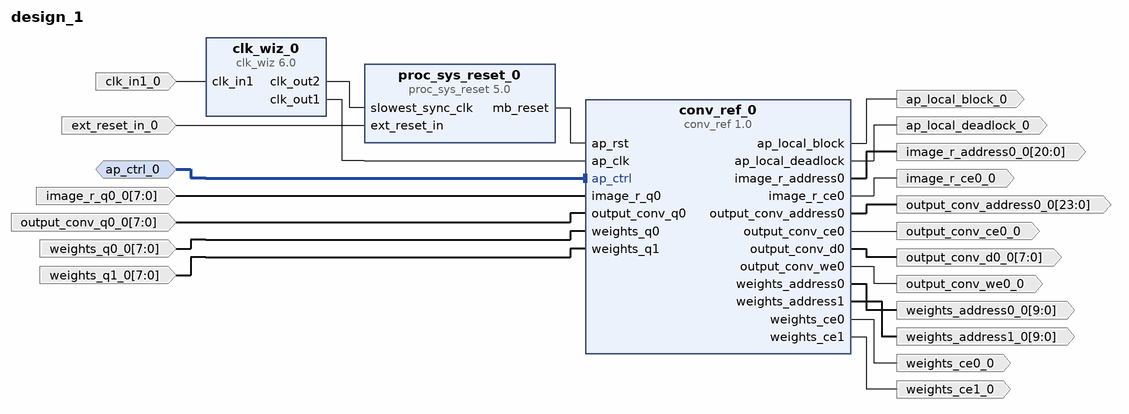
[diagram p0: block diagram of the top level]
# Vivado block design design_1, xczu7ev-ffvc1156-2-e, Vivado 2021.2
create_bd_design design_1

create_bd_intf_port -mode Slave -vlnv xilinx.com:interface:acc_handshake_rtl:1.0 ap_ctrl_0
create_bd_port -dir O ap_local_block_0
create_bd_port -dir O ap_local_deadlock_0
create_bd_port -dir O -from 20 -to 0 -type data image_r_address0_0
create_bd_port -dir O image_r_ce0_0
create_bd_port -dir I -from 7 -to 0 -type data image_r_q0_0
create_bd_port -dir O -from 23 -to 0 -type data output_conv_address0_0
create_bd_port -dir O output_conv_ce0_0
create_bd_port -dir O -from 7 -to 0 -type data output_conv_d0_0
create_bd_port -dir I -from 7 -to 0 -type data output_conv_q0_0
create_bd_port -dir O output_conv_we0_0
create_bd_port -dir O -from 9 -to 0 -type data weights_address0_0
create_bd_port -dir O -from 9 -to 0 -type data weights_address1_0
create_bd_port -dir O weights_ce0_0
create_bd_port -dir O weights_ce1_0
create_bd_port -dir I -from 7 -to 0 -type data weights_q0_0
create_bd_port -dir I -from 7 -to 0 -type data weights_q1_0
create_bd_port -dir I -type clk clk_in1_0
create_bd_port -dir I -type rst ext_reset_in_0

create_bd_cell -type ip -vlnv xilinx.com:hls:conv_ref:1.0 conv_ref_0
create_bd_cell -type ip -vlnv xilinx.com:ip:proc_sys_reset:5.0 proc_sys_reset_0
create_bd_cell -type ip -vlnv xilinx.com:ip:clk_wiz:6.0 clk_wiz_0
set_property -dict [list \
  CONFIG.CLKOUT2_JITTER 132.683 \
  CONFIG.CLKOUT2_PHASE_ERROR 87.180 \
  CONFIG.CLKOUT2_REQUESTED_OUT_FREQ 50.000 \
  CONFIG.CLKOUT2_USED true \
  CONFIG.MMCM_CLKOUT1_DIVIDE 24 \
  CONFIG.NUM_OUT_CLKS 2 \
  CONFIG.USE_LOCKED false \
  CONFIG.USE_RESET false \
] [get_bd_cells clk_wiz_0]

# ---- connections ----

connect_bd_intf_net -intf_net ap_ctrl_0_1 [get_bd_intf_ports ap_ctrl_0] [get_bd_intf_pins conv_ref_0/ap_ctrl]
connect_bd_net -net clk_in1_0_1 [get_bd_ports clk_in1_0] [get_bd_pins clk_wiz_0/clk_in1]
connect_bd_net [get_bd_pins clk_wiz_0/clk_out1] [get_bd_pins conv_ref_0/ap_clk]
connect_bd_net [get_bd_pins clk_wiz_0/clk_out2] [get_bd_pins proc_sys_reset_0/slowest_sync_clk]
connect_bd_net [get_bd_pins conv_ref_0/ap_local_block] [get_bd_ports ap_local_block_0]
connect_bd_net [get_bd_pins conv_ref_0/ap_local_deadlock] [get_bd_ports ap_local_deadlock_0]
connect_bd_net [get_bd_pins conv_ref_0/image_r_address0] [get_bd_ports image_r_address0_0]
connect_bd_net [get_bd_pins conv_ref_0/image_r_ce0] [get_bd_ports image_r_ce0_0]
connect_bd_net [get_bd_pins conv_ref_0/output_conv_address0] [get_bd_ports output_conv_address0_0]
connect_bd_net [get_bd_pins conv_ref_0/output_conv_ce0] [get_bd_ports output_conv_ce0_0]
connect_bd_net [get_bd_pins conv_ref_0/output_conv_d0] [get_bd_ports output_conv_d0_0]
connect_bd_net [get_bd_pins conv_ref_0/output_conv_we0] [get_bd_ports output_conv_we0_0]
connect_bd_net [get_bd_pins conv_ref_0/weights_address0] [get_bd_ports weights_address0_0]
connect_bd_net [get_bd_pins conv_ref_0/weights_address1] [get_bd_ports weights_address1_0]
connect_bd_net [get_bd_pins conv_ref_0/weights_ce0] [get_bd_ports weights_ce0_0]
connect_bd_net [get_bd_pins conv_ref_0/weights_ce1] [get_bd_ports weights_ce1_0]
connect_bd_net -net ext_reset_in_0_1 [get_bd_ports ext_reset_in_0] [get_bd_pins proc_sys_reset_0/ext_reset_in]
connect_bd_net -net image_r_q0_0_1 [get_bd_ports image_r_q0_0] [get_bd_pins conv_ref_0/image_r_q0]
connect_bd_net -net output_conv_q0_0_1 [get_bd_ports output_conv_q0_0] [get_bd_pins conv_ref_0/output_conv_q0]
connect_bd_net [get_bd_pins proc_sys_reset_0/mb_reset] [get_bd_pins conv_ref_0/ap_rst]
connect_bd_net -net weights_q0_0_1 [get_bd_ports weights_q0_0] [get_bd_pins conv_ref_0/weights_q0]
connect_bd_net -net weights_q1_0_1 [get_bd_ports weights_q1_0] [get_bd_pins conv_ref_0/weights_q1]

validate_bd_design
save_bd_design
